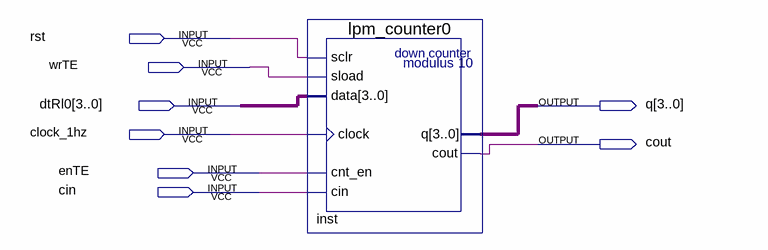
[diagram p0: schematic sheet]
// Quartus schematic contador_temp.bdf as structural Verilog: 1 symbols, 8 pins
module contador_temp (
  input  rst,
  input  wrTE,
  input  [3:0] dtRl0,
  input  clock_1hz,
  input  enTE,
  input  cin,
  output [3:0] q,
  output cout
);

  lpm_counter0 inst (
    .sclr(rst), .sload(wrTE), .data(dtRl0), .clock(clock_1hz), .cnt_en(enTE), .cin(cin), .cout(cout), .q(q));
endmodule
